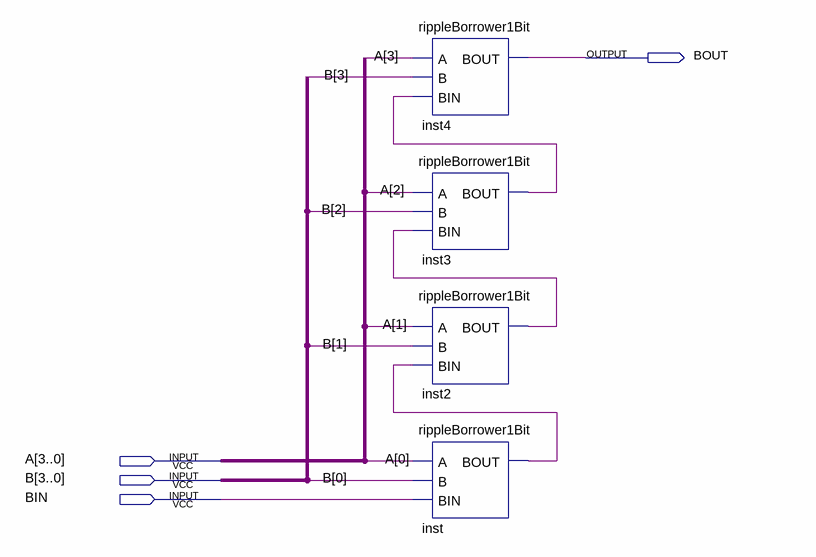
[diagram p0: schematic sheet]
// Quartus schematic rippleBorrower4Bit.bdf as structural Verilog: 4 symbols, 4 pins
module rippleBorrower4Bit (
  input  [3:0] A,
  input  [3:0] B,
  input  BIN,
  output BOUT
);

  wire inst2_bout, inst3_bout, inst_bout;

  rippleBorrower1Bit inst4 (.A(A[3]), .B(B[3]), .BIN(inst3_bout), .BOUT(BOUT));
  rippleBorrower1Bit inst3 (.A(A[2]), .B(B[2]), .BIN(inst2_bout), .BOUT(inst3_bout));
  rippleBorrower1Bit inst2 (.A(A[1]), .B(B[1]), .BIN(inst_bout), .BOUT(inst2_bout));
  rippleBorrower1Bit inst (.A(A[0]), .B(B[0]), .BIN(BIN), .BOUT(inst_bout));
endmodule
